# Altium schematic sheet NRF52840.SchDoc
size A4
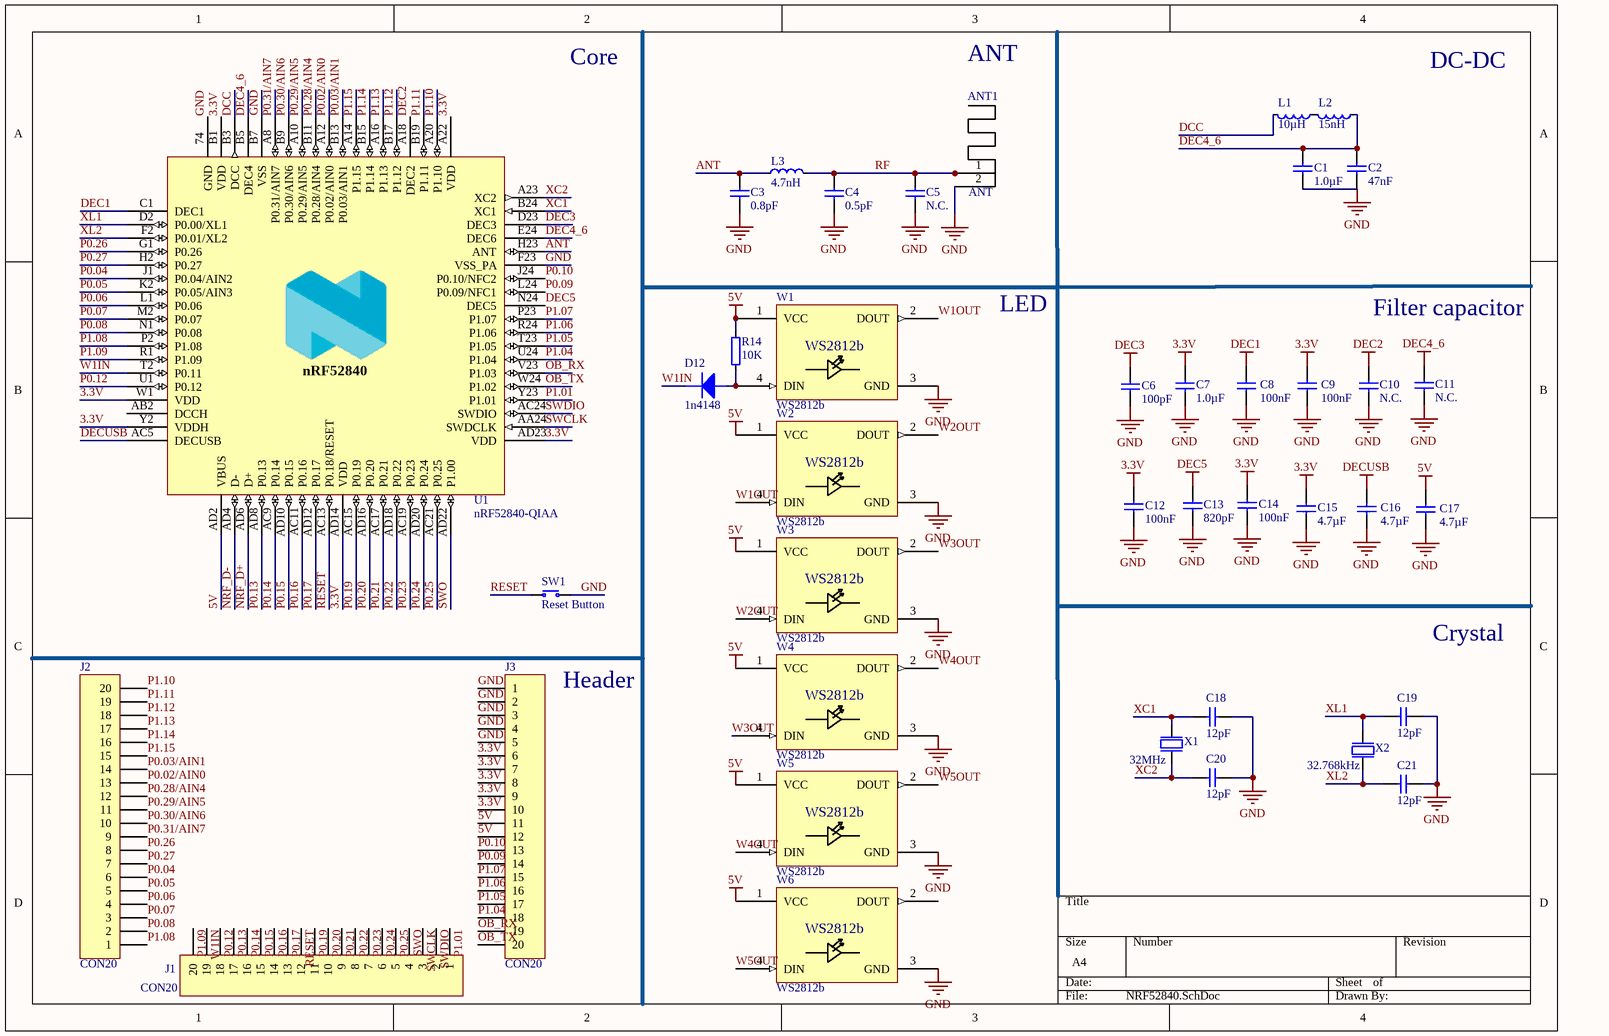
[diagram p0: NRF52840.SchDoc]

## Parts
ANT1  ANT  [ANT-PCB-2.4G-IFA-AN043-TI-ORIGIN]
C1  1.0µF  [C 0402_L]
C2  47nF  [C 0402_L]
C3  0.8pF  [C 0402_L]
C4  0.5pF  [C 0402_L]
C5  N.C.  [C 0402_L]
C6  100pF  [C 0402_L]
C7  1.0µF  [C 0402_L]
C8  100nF  [C 0402_L]
C9  100nF  [C 0402_L]
C10  N.C.  [C 0402_L]
C11  N.C.  [C 0402_L]
C12  100nF  [C 0402_L]
C13  820pF  [C 0402_L]
C14  100nF  [C 0402_L]
C15  4.7µF  [C 0402_L]
C16  4.7µF  [C 0402_L]
C17  4.7µF  [C 0402_L]
C18  12pF  [C 0402_L]
C19  12pF  [C 0402_L]
C20  12pF  [C 0402_L]
C21  12pF  [C 0402_L]
D12  1n4148  [SOD-123]
J1  CON20  [HDR2.54-LI-20P]
J2  CON20  [HDR2.54-LI-20P]
J3  CON20  [HDR2.54-LI-20P]
L1  10µH  [L 0603]
L2  15nH  [L 0603]
L3  4.7nH  [L 0402]
R14  10K  [R 0603_L]
SW1  Reset Button  [TSW SMD-6*6*5]
U1  nRF52840-QIAA  [AQFN50P700X700X85_HS-74N]
W1  WS2812b  [DIOC500500X250_NR]
W2  WS2812b  [DIOC500500X250_NR]
W3  WS2812b  [DIOC500500X250_NR]
W4  WS2812b  [DIOC500500X250_NR]
W5  WS2812b  [DIOC500500X250_NR]
W6  WS2812b  [DIOC500500X250_NR]
X1  32MHz  [OSC 3225-4P]
X2  32.768kHz  [OSC 3215-2P]

## Nets
3.3V: C7.1 C9.1 C12.1 C14.1 C15.1 J3.6 J3.7 J3.8 J3.9 J3.10 U1.A22(VDD) U1.AD14(VDD) U1.AD23(VDD) U1.B1(VDD) U1.W1(VDD) U1.Y2(VDDH)
5V: C17.1 J3.11 J3.12 R14.1 U1.AD2(VBUS) W1.1(VCC) W2.1(VCC) W3.1(VCC) W4.1(VCC) W5.1(VCC) W6.1(VCC)
DEC1: C8.1 U1.C1(DEC1)
DEC2: C10.1 U1.A18(DEC2)
DEC3: C6.2 U1.D23(DEC3)
DEC4_6: C1.2 C2.1 C11.1 L2.1 U1.B5(DEC4) U1.E24(DEC6)
DEC5: C13.1 U1.N24(DEC5)
DECUSB: C16.1 U1.AC5(DECUSB)
GND: ANT1.2 C1.1 C2.2 C3.1 C4.1 C5.2 C6.1 C7.2 C8.2 C9.2 C10.2 C11.2 C12.2 C13.2 C14.2 C15.2 C16.2 C17.2 C18.2 C19.2 C20.2 C21.2 J3.1 J3.2 J3.3 J3.4 J3.5 SW1.1(N.O) U1.74(GND) U1.B7(VSS) U1.F23(VSS_PA) W1.3(GND) W2.3(GND) W3.3(GND) W4.3(GND) W5.3(GND) W6.3(GND) X1.2(GND) X1.4(GND)
ANT: C3.2 L3.1 U1.H23(ANT)
DCC: L1.2 U1.B3(DCC)
NRF_D+: U1.AD6(D+)
NRF_D-: U1.AD4(D-)
OB_RX: J3.19 U1.V23(P1.03)
OB_TX: J3.20 U1.W24(P1.02)
P0.02/AIN0: J2.13 U1.A12(P0.02/AIN0)
P0.03/AIN1: J2.14 U1.B13(P0.03/AIN1)
P0.04: J2.6 U1.J1(P0.04/AIN2)
P0.05: J2.5 U1.K2(P0.05/AIN3)
P0.06: J2.4 U1.L1(P0.06)
P0.07: J2.3 U1.M2(P0.07)
P0.08: J2.2 U1.N1(P0.08)
P0.09: J3.14 U1.L24(P0.09/NFC1)
P0.10: J3.13 U1.J24(P0.10/NFC2)
P0.12: J1.18 U1.U1(P0.12)
P0.13: J1.17 U1.AD8(P0.13)
P0.14: J1.16 U1.AC9(P0.14)
P0.15: J1.15 U1.AD10(P0.15)
P0.16: J1.14 U1.AC11(P0.16)
P0.17: J1.13 U1.AD12(P0.17)
P0.19: J1.11 U1.AC15(P0.19)
P0.20: J1.10 U1.AD16(P0.20)
P0.21: J1.9 U1.AC17(P0.21)
P0.22: J1.8 U1.AD18(P0.22)
P0.23: J1.7 U1.AC19(P0.23)
P0.24: J1.6 U1.AD20(P0.24)
P0.25: J1.5 U1.AC21(P0.25)
P0.26: J2.8 U1.G1(P0.26)
P0.27: J2.7 U1.H2(P0.27)
P0.28/AIN4: J2.12 U1.B11(P0.28/AIN4)
P0.29/AIN5: J2.11 U1.A10(P0.29/AIN5)
P0.30/AIN6: J2.10 U1.B9(P0.30/AIN6)
P0.31/AIN7: J2.9 U1.A8(P0.31/AIN7)
P1.01: J1.1 U1.Y23(P1.01)
P1.04: J3.18 U1.U24(P1.04)
P1.05: J3.17 U1.T23(P1.05)
P1.06: J3.16 U1.R24(P1.06)
P1.07: J3.15 U1.P23(P1.07)
P1.08: J2.1 U1.P2(P1.08)
P1.09: J1.20 U1.R1(P1.09)
P1.10: J2.20 U1.A20(P1.10)
P1.11: J2.19 U1.B19(P1.11)
P1.12: J2.18 U1.B17(P1.12)
P1.13: J2.17 U1.A16(P1.13)
P1.14: J2.16 U1.B15(P1.14)
P1.15: J2.15 U1.A14(P1.15)
RESET: J1.12 SW1.2(COM) U1.AC13(P0.18/RESET)
RF: ANT1.1 C4.2 C5.1 L3.2
SWCLK: J1.3 U1.AA24(SWDCLK)
SWDIO: J1.2 U1.AC24(SWDIO)
SWO: J1.4 U1.AD22(P1.00)
W1IN: D12.2(K) J1.19 U1.T2(P0.11)
W1OUT: W1.2(DOUT) W2.4(DIN)
W2OUT: W2.2(DOUT) W3.4(DIN)
W3OUT: W3.2(DOUT) W4.4(DIN)
W4OUT: W4.2(DOUT) W5.4(DIN)
W5OUT: W5.2(DOUT) W6.4(DIN)
XC1: C18.1 U1.B24(XC1) X1.3(out)
XC2: C20.1 U1.A23(XC2) X1.1(inp)
XL1: C19.1 U1.D2(P0.00/XL1) X2.2(out)
XL2: C21.1 U1.F2(P0.01/XL2) X2.1(inp)
NetD12_1: D12.1(A) R14.2 W1.4(DIN)
NetL1_1: L1.1 L2.2

Not connected (* = marked no-connect by the designer): U1 AB2(DCCH); W6 2(DOUT)

## Notes on the sheet
- Core
- ANT
- DC-DC
- LED
- Filter capacitor
- Crystal
- Header
- (in symbol nRF52840-QIAAD0) nRF52840

## Library data of the parts
C1 C7 = C0603-1µ0: Capacitor, X7R, ±10%; Note: 16V; Part Number: C0603-1µ0; LatestRevisionDate: 2013-06-05; Pin Count: 2; Publisher: Nordic Semiconductor; Published: 2009-05-08; Value: 1.0µF; Footprint Doc: 0603
C2 = C0402-47n: Capacitor, X7R, ±10%; Note: Chip Cap 10%; Part Number: C0402-47n; LatestRevisionDate: 2009-05-08; Pin Count: 2; Publisher: Nordic Semiconductor; Published: 2009-05-08; Value: 47nF; Footprint Doc: 0402
C3 = C0402-0.8p: Capacitor, NP0, ±10%; Note: 50V; Part Number: C0402-0.8p; LatestRevisionDate: 2012-11-21; Pin Count: 2; Publisher: Nordic Semiconductor; Published: 2009-05-08; Value: 0.8pF; Footprint Doc: 0402
C4 = C0402-0.5p: Capacitor, NP0, ±10%; Note: 50V; Part Number: C0402-0.5p; LatestRevisionDate: 2017-02-23; Pin Count: 2; Publisher: Nordic Semiconductor; Published: 2009-05-08; Value: 0.5pF; Footprint Doc: 0402
C5 = C0402-N.C.: Not mounted; Note: Chip Cap; Assembly: Not mounted; Part Number: C0402-N.C.; LatestRevisionDate: 2009-05-08; Pin Count: 2; Publisher: Nordic Semiconductor; Published: 2009-05-08; Value: N.C.; Footprint Doc: 0402
C6 = C0402-100p: Capacitor, NP0, ±5%; Note: 50V; Part Number: C0402-100p; LatestRevisionDate: 2009-05-08; Pin Count: 2; Publisher: Nordic Semiconductor; Published: 2009-05-08; Value: 100pF; Footprint Doc: 0402
C8 C9 C12 C14 = C0402-100n: Capacitor, X7R, ±10%; Note: 16V; Part Number: C0402-100n; LatestRevisionDate: 2009-11-23; Pin Count: 2; Publisher: Nordic Semiconductor; Published: 2009-05-08; Value: 100nF; Footprint Doc: 0402
C10 C11 = C0402-N.C.: Not mounted; Assembly: Not mounted; Part Number: C0402-N.C.; LatestRevisionDate: 2009-05-08; Pin Count: 2; Publisher: Nordic Semiconductor; Published: 2009-05-08; Value: N.C.; Footprint Doc: 0402
C13 = C0402-820p: Capacitor, NP0, ±5%; Note: 50V; Part Number: C0402-820p; LatestRevisionDate: 2009-05-08; Pin Count: 2; Publisher: Nordic Semiconductor; Published: 2009-05-08; Value: 820pF; Footprint Doc: 0402
C15 C16 = C0603-4µ7-6.3V-X7R: Capacitor, X7R, ±10%; Note: 6.3V; Part Number: C0603-4µ7-6.3V-X7R; LatestRevisionDate: 2015-06-10; Pin Count: 2; Publisher: Nordic Semiconductor; Published: 2015-06-10; Value: 4.7µF; Footprint Doc: 0603
C17 = C0603-4µ7-10V-X7S: Capacitor, X7S, ±10%; Note: 10V; Part Number: C0603-4µ7-10V-X7S; LatestRevisionDate: 2016-08-15; Pin Count: 2; Publisher: Nordic Semiconductor; Published: 2016-08-15; Value: 4.7µF; Footprint Doc: 0603
C18-C21 = C0402-12p: Capacitor, NP0, ±2%; Note: 50V; Part Number: C0402-12p; LatestRevisionDate: 2011-05-11; Pin Count: 2; Publisher: Nordic Semiconductor; Published: 2009-05-08; Value: 12pF; Footprint Doc: 0402
D12 = ZENER3: Zener Diode
J1-J3 = CON20: Connector
L1 = L0603-10µ: Chip inductor, IDC,min = 50 mA, ±20%; Part Number: L0603-10µ; LatestRevisionDate: 2012-09-19; Pin Count: 2; Publisher: Nordic Semiconductor; Published: 2010-02-24; Value: 10µH; Footprint Doc: 0603
L2 = L0402-15n: High frequency chip inductor ±10%; Part Number: L0402-15n; LatestRevisionDate: 2012-09-19; Pin Count: 2; Publisher: Nordic Semiconductor; Published: 2010-07-12; Value: 15nH; Footprint Doc: 0402
L3 = L0402-4n7: High frequency chip inductor ±5%; Part Number: L0402-4n7; LatestRevisionDate: 2012-09-19; Pin Count: 2; Publisher: Nordic Semiconductor; Published: 2009-05-08; Value: 4.7nH; Note: High frequency chip inductor ±5%; Footprint Doc: 0402
R14 = RES
SW1 = SW-PB: Tactile Switch, SPNO, SMD, 160gf, 6.2x6.3x2.5mm; Part Number: Switch-PB-6.2x6.3mm-SMD; Manufacturer: Dailywell; Manufacturer Part Number: TS604VM1-025BR-R; 2nd source part number: 688-SKHUALE010; Value: PB SW; Artikkelnr Noca: 50019106; Artikkelnr Simpro: N.A.; Datasheet: \\hizz\pro\app9717\Datasheet\switches\Daliywell\TS604VM1-025BR-R.pdf; Footprint Doc: Switch-PB-6.2x6.3mm-SMD; LatestRevisionDate: 2016-04-21; Pin Count: 4; Publisher: Nordic Semiconductor; Published: 2010-02-01; Note: *; Supplier: Cabcon; Supplier part number: TS604VM1-025BR-R; 2nd source Supplier: Mouser
U1 = nRF52840-QIAAD0: Multi-protocol Bluetooth Low Energy, IEEE 802.15.4, ANT and 2.4GHz proprietary system-on-chip; Manufacturer: Nordic Semiconductor; Part Number: nRF52840-QIAAD0; LatestRevisionDate: 2018-12-04; Pin Count: 73; Publisher: Nordic Semiconductor; Published: 2018-12-04; Value: nRF52840-QIAA; Note: *; Footprint Doc: AQFN-73; Manufacturer Part Number: nRF52840-QIAAD0
W1-W6 = WS2812b_Sumasta: The Infamous Chinese Chainable RGB LED
X1 = XTAL_SMD2016_32MHz_8pF_General: XTAL SMD 2016, 32MHz, Cl=8pF, Total Tol: ±40ppm; Part Number: XTAL_SMD2016_32MHz_8pF_General; LatestRevisionDate: 2016-08-19; Pin Count: 4; Publisher: Nordic Semiconductor; Published: 2016-08-19; Value: 32MHz; Footprint Doc: XTAL_2016
X2 = XTAL_SMD3215_32.768kHz_9pF_General: XTAL SMD 3215, 32.768kHz, Cl=9pF, Total Tol: ±50ppm; Part Number: XTAL_SMD3215_32.768kHz_9pF_General; LatestRevisionDate: 2016-08-19; Pin Count: 2; Publisher: Nordic Semiconductor; Published: 2016-08-19; Value: 32.768kHz; Footprint Doc: XTAL_3215